# EAGLE design 3w-rgb-led-dongle-mk-1.0 (EAGLE 6.5.0)
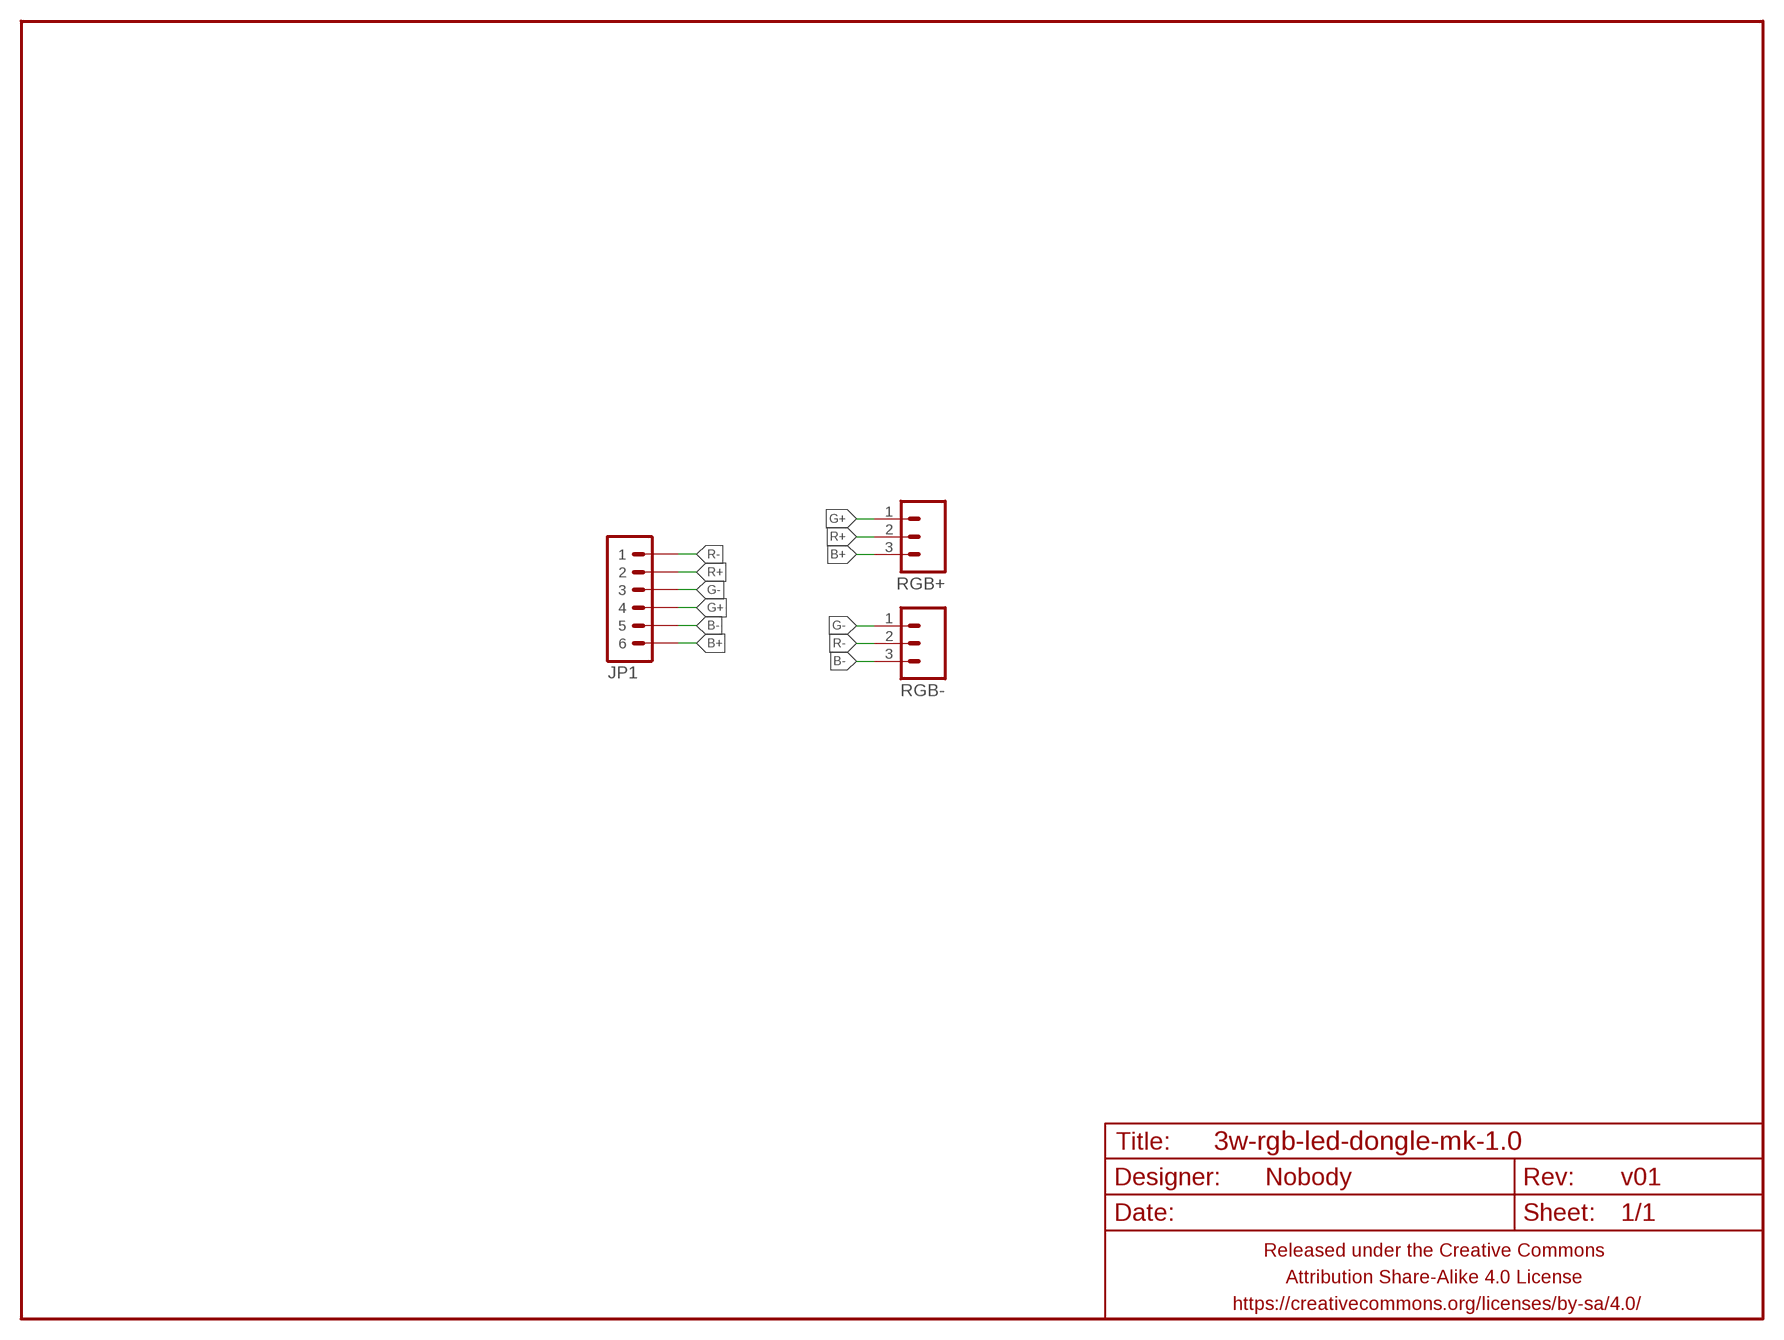
[diagram p0: schematic, sheet 1]

## Parts
FRAME1  FRAME-LETTERNO_PACKAGE  [DUMMY]
JP1  M06JST-XH-RA-PTH-LONG  [1X06-2.5MM-JST-XH-RA-LONG]
RGB+  M03JST-3-XH-RA-PTH-LONG  [JST-3-XH-RA-PTH-LONG]
RGB-  M03JST-3-XH-RA-PTH-LONG  [JST-3-XH-RA-PTH-LONG]

## Nets
B+: JP1.6 RGB+.3
B-: JP1.5 RGB-.3
G+: JP1.4 RGB+.1
G-: JP1.3 RGB-.1
R+: JP1.2 RGB+.2
R-: JP1.1 RGB-.2

## Library data of the parts
FRAME1 = A_butts:FRAME-LETTER: Schematic Frame Standard 8.5x11 US Letter frame; DESIGNER: Nobody; VERSION: v01
JP1 = A_butts:M06: Header 6 Standard 6-pin 0.1" header. Use with straight break away headers (SKU : PRT-00116), right angle break away headers (PRT-00553), swiss pins (PRT-00743), machine pins (PRT-00117), and female headers (PRT-00115). Molex polarized connector foot print use with SKU : PRT-08094 with associated crimp pins and housings. NOTES ON THE VARIANTS LOCK and LOCK_LONGPADS... This footprint was designed to help hold the alignment of a through-hole component (i.e. 6-pin header) while soldering it into place. You may notice that each hole has been shifted either up or down by 0.005 of an inch from it's more standard position (which is a perfectly straight line). This slight alteration caused the pins (the squares in the middle) to touch the edges of the holes. Because they are alternating, it causes a "brace" to hold the component in place. 0.005 has proven to be the perfect amount of "off-center" position when using our standard breakaway headers. Although looks a little odd when you look at the bare footprint, once you have a header in there, the alteration is very hard to notice. Also,if you push a header all the way into place, it is covered up entirely on the bottom side. This idea of altering the position of holes to aid alignment will be further integrated into the Sparkfun Library for other footprints. It can help hold any component with 3 or more connection pins.
RGB+ RGB- = A_butts:M03: Header 3 Standard 3-pin 0.1" header. Use with straight break away headers (SKU : PRT-00116), right angle break away headers (PRT-00553), swiss pins (PRT-00743), machine pins (PRT-00117), and female headers (PRT-00115). Molex polarized connector foot print use with SKU : PRT-08232 with associated crimp pins and housings.

## Board
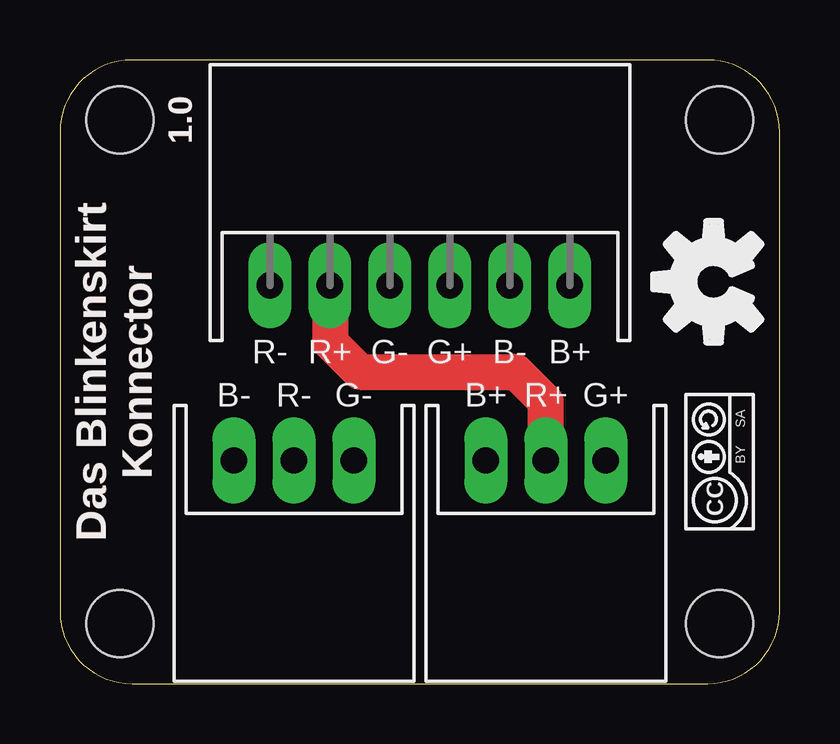
[diagram p1: board, top side]
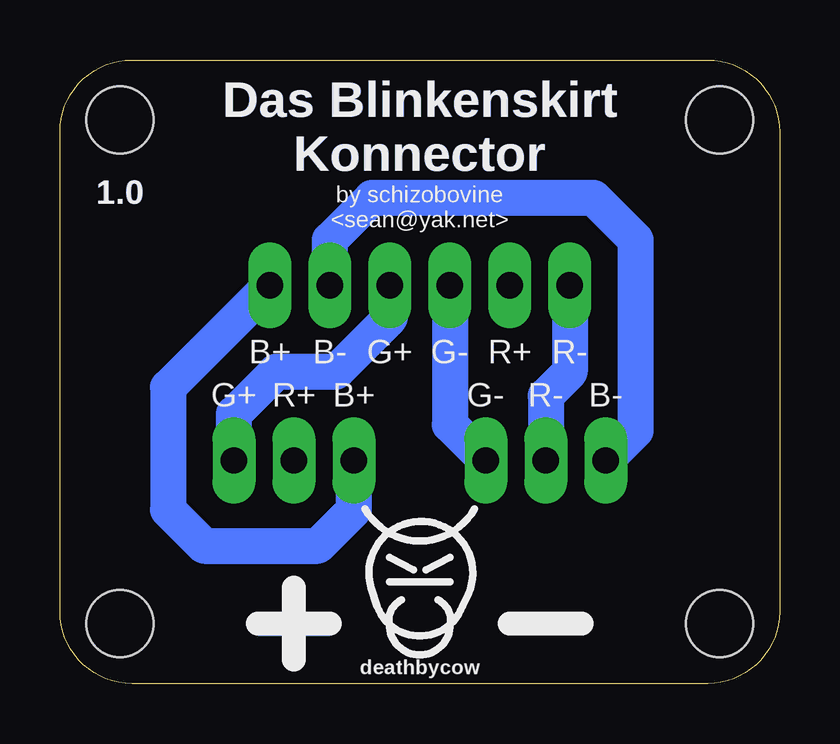
[diagram p2: board, bottom side, seen from below]

Size 30 x 26 mm. Coordinates in mm from the lower left corner, seen from the top.
Outline: 0,23 0,3 arc90 3,0 27,0 arc90 30,3 30,23 arc90 27,26 3,26 arc90 0,23
Copper layers (1*16): Top 0.0356mm / dielectric 1.5011mm / Bottom 0.0356mm
Design rules "LaenPCBOrder_2": minimum track width 6mil, minimum drill 13mil, track to track 6mil, track to pad 6mil, pad to pad 6mil, via to via 6mil, smd to smd 6mil, copper to edge 15mil, drill to drill 6mil, minimum pad ring 7mil, minimum via ring 7mil, stop-mask expansion 3mil, vias tented up to drill 20mil, thermal gap 10mil
Holes 2.8 mm at 2.5,23.5 27.5,2.5 2.5,2.5 27.5,23.5

### Footprints (pad centres in the part's own frame; a part is rotated, then mirrored left to right if it is on the bottom)
1X06-2.5MM-JST-XH-RA-LONG = drill 1.1 pad 1.8 long: 1 0,0; 2 2.5,0; 3 5,0; 4 7.5,0; 5 10,0; 6 12.5,0
JST-3-XH-RA-PTH-LONG = drill 1.1 pad 1.8 long: 1 -2.5,0; 2 0,0; 3 2.5,0

### Placement (x,y rotation side)
FRAME1  0.5,0.5 0 top
JP1  8.75,16.6 0 top
RGB+  20.25,9.3 180 top
RGB-  9.75,9.3 180 top
U$1  [CC-BY-SA-4.0-NO-URL]  27.5,9.25 90 top
U$2  [COW_SMALL]  15,4.75 0 bottom
U$3  [OSHWLOGO_TOP_0.2]  27.25,16.75 90 top

### Tracks (layer width: path | path; a pad name or v marks a point on that pad's centre or on a via)
B+
  Bottom 1.5: JP1.6 25.5,12.35 25.5,7.25 24,5.75 19.25,5.75 17.75,7.25 RGB+.3
B-
  Bottom 1.5: RGB-.3 6,10.55 6,18.5 7.75,20.25 17,20.25 18.75,18.5 JP1.5
G+
  Bottom 1.5: JP1.4 16.25,15.25 18.5,13 21,13 22.75,11.25 RGB+.1
G-
  Bottom 1.5: JP1.3 13.75,10.8 RGB-.1
N$1
  Bottom 1: 8.25,2.5 11.25,2.5
PLUS
  Bottom 1: 20.25,2.5 20.25,4 | 20.25,1 20.25,2.5 | 20.25,2.5 18.75,2.5 | 21.75,2.5 20.25,2.5
R+
  Top 1.5: JP1.2 11.25,14.25 12.5,13 19,13 20.25,11.75 RGB+.2
R-
  Bottom 1.5: JP1.1 8.75,13 9.75,12 RGB-.2

### Text on the board
Top: Das Blinkenskirt / Konnector
Bottom: Das Blinkenskirt / Konnector
tPlace: R- | R+ | G- | G+ | B- | B+ | Das Blinkenskirt / Konnector | B- | R- | G- | B+ | R+ | G+
bPlace: Das Blinkenskirt / Konnector | by schizobovine / <sean@yak.net> | R- | R+ | G- | G+ | B- | B+ | B- | R- | G- | B+ | R+ | G+